# EAGLE design fancoil (EAGLE 9.6.2)
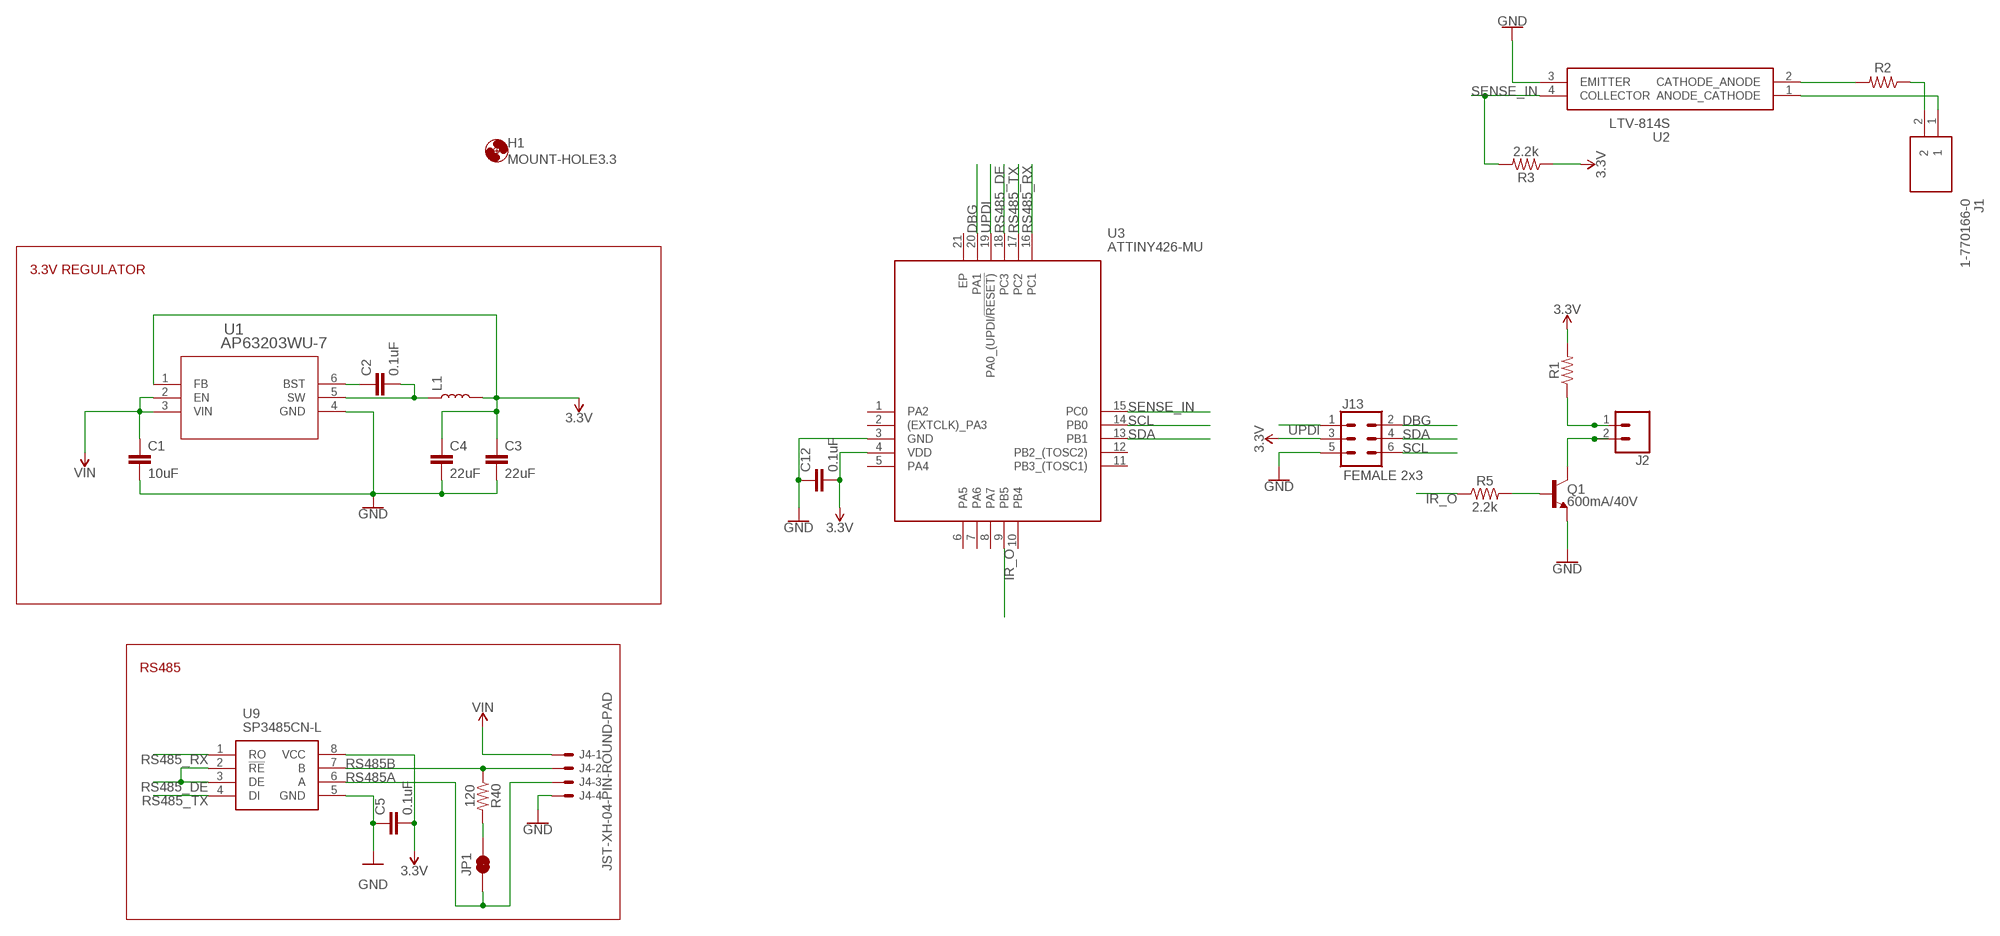
[diagram p0: schematic, sheet 1]

## Parts
C1  10uF  10UF-1206-6.3V-20%  [1206]
C2  0.1uF  0.1UF-0603-25V-5%  [0603]
C3  22uF  22UF-0805-6.3V-20%  [0805]
C4  22uF  22UF-0805-6.3V-20%  [0805]
C5  0.1uF  0.1UF-0603-25V-5%  [0603]
C12  0.1uF  0.1UF-0603-25V-5%  [0603]
H1  MOUNT-HOLE3.3  [3,3]
J1  1-770166-0  [17701660]
J2  CONN_02  [1X02]
J4  JST-XH-04-PIN-ROUND-PAD  [JST-XH-04-PACKAGE-ROUND-PAD]
J13  FEMALE 2x3  CONN_03X2FEMALE  [2X3]
JP1  JUMPER-SMT_2_NC_TRACE_NO-SILK  [SMT-JUMPER_2_NC_TRACE_NO-SILK]
L1  4.7μH_SHIELDED_INDUCTOR  [1008(2520)]
Q1  600mA/40V  TRANS_NPN-MMBT2222AL  [SOT23-3]
R1  68OHM-0603-1/10W-1%  [0603]
R2  RESISTORAXIAL-0.3  [AXIAL-0.3]
R3  2.2k  2.2KOHM-0603-1/10W-1%  [0603]
R5  2.2k  2.2KOHM-0603-1/10W-1%  [0603]
R40  120  120OHM-0603-1/10W-5%  [0603]
U1  AP63203WU-7  [SOIC_05WU-7_DIO]
U2  LTV-814S  [SOP254P1016X460-4N]
U3  ATTINY426-MU  [QFN40P300X300X90-21N]
U9  SP3485CN-L  [SOIC127P600X175-8N]

## Nets
3.3V: C3.1 C4.1 C5.2 C12.2 J13.3 L1.2 R1.2 R3.1 U1.1(FB) U3.4(VDD) U9.8(VCC)
DBG: J13.2 U3.20(PA1)
GND: C1.2 C3.2 C4.2 C5.1 C12.1 J4.4 J13.5 Q1.2(E) U1.4(GND) U2.3(EMITTER) U3.3(GND) U9.5(GND)
IR_O: R5.1 U3.9(PB5)
N$1: C2.2 L1.1 U1.5(SW)
N$2: C2.1 U1.6(BST)
N$3: JP1.2 R40.2
N$4: J2.1 R1.1
N$5: Q1.1(B) R5.2
N$6: J1.2 R2.P$1
N$7: J1.1 U2.1(ANODE_CATHODE)
N$8: R2.P$2 U2.2(CATHODE_ANODE)
N$10: J2.2 Q1.3(C)
RS485_DE: U3.18(PC3) U9.2(!RE) U9.3(DE)
RS485_RX: U3.16(PC1) U9.1(RO)
RS485_TX: U3.17(PC2) U9.4(DI)
RS485A: J4.3 JP1.1 U9.6(A)
RS485B: J4.2 R40.1 U9.7(B)
SCL: J13.6 U3.14(PB0)
SDA: J13.4 U3.13(PB1)
SENSE_IN: R3.2 U2.4(COLLECTOR) U3.15(PC0)
UPDI: J13.1 U3.19(PA0_(UPDI/!RESET))
VIN: C1.1 J4.1 U1.2(EN) U1.3(VIN)
Unconnected: U3.1(PA2) U3.2((EXTCLK)_PA3) U3.5(PA4) U3.6(PA5) U3.7(PA6) U3.8(PA7) U3.10(PB4) U3.11(PB3_(TOSC1)) U3.12(PB2_(TOSC2)) U3.21(EP)

## Notes on the sheet
- 3.3V REGULATOR
- RS485

## Library data of the parts
C1 = SparkFun-Capacitors:10UF: 10.0µF ceramic capacitors A capacitor is a passive two-terminal electrical component used to store electrical energy temporarily in an electric field.; PROD_ID: CAP-10057
C2 C5 C12 = SparkFun-Capacitors:0.1UF: 0.1µF ceramic capacitors A capacitor is a passive two-terminal electrical component used to store electrical energy temporarily in an electric field.; PROD_ID: CAP-08604
C3 C4 = SparkFun-Capacitors:22UF: 22µF ceramic capacitors A capacitor is a passive two-terminal electrical component used to store electrical energy temporarily in an electric field.; PROD_ID: CAP-08402
H1 = holes:MOUNT-HOLE: MOUNTING HOLE with drill center marker
J1 = Terminals and sockets:1-770166-0: 2w Vertical pin header Tin TE Connectivity MATE-N-LOK Series, 4.14mm Pitch 2 Way Straight Heavy Duty Power Connector, Solder Termination, 9.5A Source: Datasheet <https://www.te.com/commerce/DocumentDelivery/DDEController?Action=showdoc&DocId=Customer Drawing770166MpdfEnglishENG_CD_770166_M.pdf1-770166-0>; DESCRIPTION: 2w Vertical pin header Tin TE Connectivity MATE-N-LOK Series, 4.14mm Pitch 2 Way Straight Heavy Duty Power Connector, Solder Termination, 9.5A; HEIGHT: 14.25mm; MANUFACTURER_NAME: TE Connectivity; MANUFACTURER_PART_NUMBER: 1-770166-0; MOUSER_PART_NUMBER: 571-1-770166-0; MOUSER_PRICE-STOCK: https://www.mouser.co.uk/ProductDetail/TE-Connectivity-AMP/1-770166-0?qs=m8myXnDJXpW%252BZqFFniy0cw%3D%3D
J2 = SparkFun-Connectors:CONN_02: Multi connection point. Often used as Generic Header-pin footprint for 0.1 inch spaced/style header connections On any of the 0.1 inch spaced packages, you can populate with these: Break Away Headers - Straight <https://www.sparkfun.com/products/116> (PRT-00116) Break Away Male Headers - Right Angle <https://www.sparkfun.com/products/553> (PRT-00553) Female Headers <https://www.sparkfun.com/products/115> (PRT-00115) Break Away Headers - Machine Pin <https://www.sparkfun.com/products/117> (PRT-00117) Break Away Female Headers - Swiss Machine Pin <https://www.sparkfun.com/products/743> (PRT-00743) For SCREWTERMINALS and SPRING TERMINALS visit here: Screw Terimnals on SparkFun.com <https://www.sparkfun.com/search/results?term=Screw+Terminals> (5mm/3.5mm/2.54mm spacing) This device is also useful as a general connection point to wire up your design to another part of your project. Our various solder wires solder well into these plated through hole pads. Hook-Up Wire - Assortment (Stranded, 22 AWG) <https://www.sparkfun.com/products/11375> (PRT-11375) Hook-Up Wire - Assortment (Solid Core, 22 AWG) <https://www.sparkfun.com/products/11367> (PRT-11367) View the entire wire category on our website here <https://www.sparkfun.com/categories/141> Special notes: Molex polarized connector foot print use with: PRT-08233 with associated crimp pins and housings. 2.54_SCREWTERM for use with PRT-10571. 3.5mm Screw Terminal footprints for PRT-08084 5mm Screw Terminal footprints for use with PRT-08432
J4 = Rembrandt Electronics - JST XH Connectors v1-0:JST-XH-04-PIN: JST XH Connector 2 Pin Wire to board connector. Pitch: 2,54 mm, (0.100") Number of pins: 4 Created by Rembrandt Electronics www.rembrandtelectronics.com
J13 = SparkFun-Connectors:CONN_03X2: Multi connection point. Often used as Generic Header-pin footprint for 0.1 inch spaced/style header connections You can populate with any combo of single row headers, but if you'd like an exact match, check these: Header - 2x3 (Male, 0.1") <https://www.sparkfun.com/products/12807> (PRT-12807) Header - 2x3 (Female, 0.1") <https://www.sparkfun.com/products/13010> (PRT-13010) 2x3 Pin Shrouded Header <https://www.sparkfun.com/products/10877> (PRT-10877) On any of the 0.1 inch spaced packages, you can populate with these: Break Away Headers - Straight <https://www.sparkfun.com/products/116> (PRT-00116) Break Away Male Headers - Right Angle <https://www.sparkfun.com/products/553> (PRT-00553) Female Headers <https://www.sparkfun.com/products/115> (PRT-00115) Break Away Headers - Machine Pin <https://www.sparkfun.com/products/117> (PRT-00117) Break Away Female Headers - Swiss Machine Pin <https://www.sparkfun.com/products/743> (PRT-00743) Special note: the shrouded connector mates well with our 3x2 ribbon cables: Ribbon Crimp Connector - 6-pin (2x3, Female) <https://www.sparkfun.com/products/10651> (PRT-10651) Ribbon Cable - 6 wire (15ft) <https://www.sparkfun.com/products/10646> (PRT-10646); PROD_ID: CONN-11566
JP1 = SparkFun-Jumpers:JUMPER-SMT_2_NC_TRACE: Normally closed trace jumper This jumper has a trace between two pads so it's normally closed (NC). Use a razor knife to open the connection. For best results follow the IPC guidelines for cutting traces: Cutout at least 0.063 mm (0.005 in). Remove all loose material to clean up the cut area. Seal the cut with an approved epoxy. Reapply solder to reclose the connection.
L1 = SparkFun-Coils:4.7μH_SHIELDED_INDUCTOR: 4.7uH Inductor 4.7uH 1.4A 50mOhm 1008(2520) Package Shielded; PROD_ID: NDUC-14880
Q1 = SparkFun-DiscreteSemi:TRANS_NPN: NPN transistor Current controlled devices typically used to amplify current or used as a switch. BC547 - COM-08928 <http://www.sparkfun.com/products/8928> (TO-92 45V 100mA) (1.Collector 2.Base 3.Emitter) 2N3904 - COM-00521 <http://www.sparkfun.com/products/521> (TO-92 40V 200mA) (1.Emitter 2.Base 3.Collector) P2N2222A - COM-12852 <http://www.sparkfun.com/products/12852> (TO-92 40V 600mA) (1.Collector 2.Base 3.Emitter); PROD_ID: TRANS-08049
R1 = SparkFun-Resistors:68OHM: 68Ω resistor A resistor is a passive two-terminal electrical component that implements electrical resistance as a circuit element. Resistors act to reduce current flow, and, at the same time, act to lower voltage levels within circuits. - Wikipedia
R2 = SparkFun-Resistors:RESISTOR: Generic Resistor Package
R3 R5 = SparkFun-Resistors:2.2KOHM: 2.2kΩ resistor A resistor is a passive two-terminal electrical component that implements electrical resistance as a circuit element. Resistors act to reduce current flow, and, at the same time, act to lower voltage levels within circuits. - Wikipedia; PROD_ID: RES-08272
R40 = Resistors:120OHM
U1 = Diodes buck converter:AP63203WU-7; COPYRIGHT: Copyright (C) 2023 Ultra Librarian. All rights reserved.; MANUFACTURER_PART_NUMBER: AP63203WU-7; MFR_NAME: Diodes Inc
U2 = LiteOn AC optoisolator LTV:LTV-814S: Optocoupler LTV-814S Source: Datasheet <https://datasheet.datasheetarchive.com/originals/distributors/Datasheets-17/DSA-322887.pdf>; DESCRIPTION: Optocoupler LTV-814S; HEIGHT: 4.6mm; MANUFACTURER_NAME: Lite-On; MANUFACTURER_PART_NUMBER: LTV-814S; MOUSER_PART_NUMBER: 859-LTV-814S; MOUSER_PRICE-STOCK: https://www.mouser.co.uk/ProductDetail/Lite-On/LTV-814S?qs=JzJdhgWJh%252BMQRrTS0RmA%252BA%3D%3D
U3 = ATTINY426-MU:ATTINY426-MU: 8-bit Microcontrollers - MCU 20MHz, 4KB,VQFN20, Ind 85C, Green Source: Datasheet <https://www.microchip.com/content/dam/mchp/documents/MCU08/ProductDocuments/DataSheets/ATtiny424-426-427-824-826-827-DataSheet-DS40002311A.pdf>; DESCRIPTION: 8-bit Microcontrollers - MCU 20MHz, 4KB,VQFN20, Ind 85C, Green; HEIGHT: 0.9mm; MANUFACTURER_NAME: Microchip; MANUFACTURER_PART_NUMBER: ATTINY426-MU; MOUSER_PART_NUMBER: 579-ATTINY426-MU; MOUSER_PRICE-STOCK: https://www.mouser.co.uk/ProductDetail/Microchip-Technology/ATTINY426-MU?qs=pUKx8fyJudAatJqFKBSQfg%3D%3D
U9 = MaxLinear RS485 SP3485CN-L:SP3485CN-L: Transceiver RS-485 3.3V 10Mbps SOIC8 EXAR SP3485CN-L, Line Transceiver, RS-422, RS-485, 3.3 V, 8-Pin SOIC Source: Datasheet <https://componentsearchengine.com/Datasheets/1/SP3485CN-L.pdf>; DESCRIPTION: Transceiver RS-485 3.3V 10Mbps SOIC8 EXAR SP3485CN-L, Line Transceiver, RS-422, RS-485, 3.3 V, 8-Pin SOIC; HEIGHT: 1.75mm; MANUFACTURER_NAME: EXAR; MANUFACTURER_PART_NUMBER: SP3485CN-L; MOUSER_PART_NUMBER: 701-SP3485CN-L; MOUSER_PRICE-STOCK: https://www.mouser.com/Search/Refine.aspx?Keyword=701-SP3485CN-L

## Board
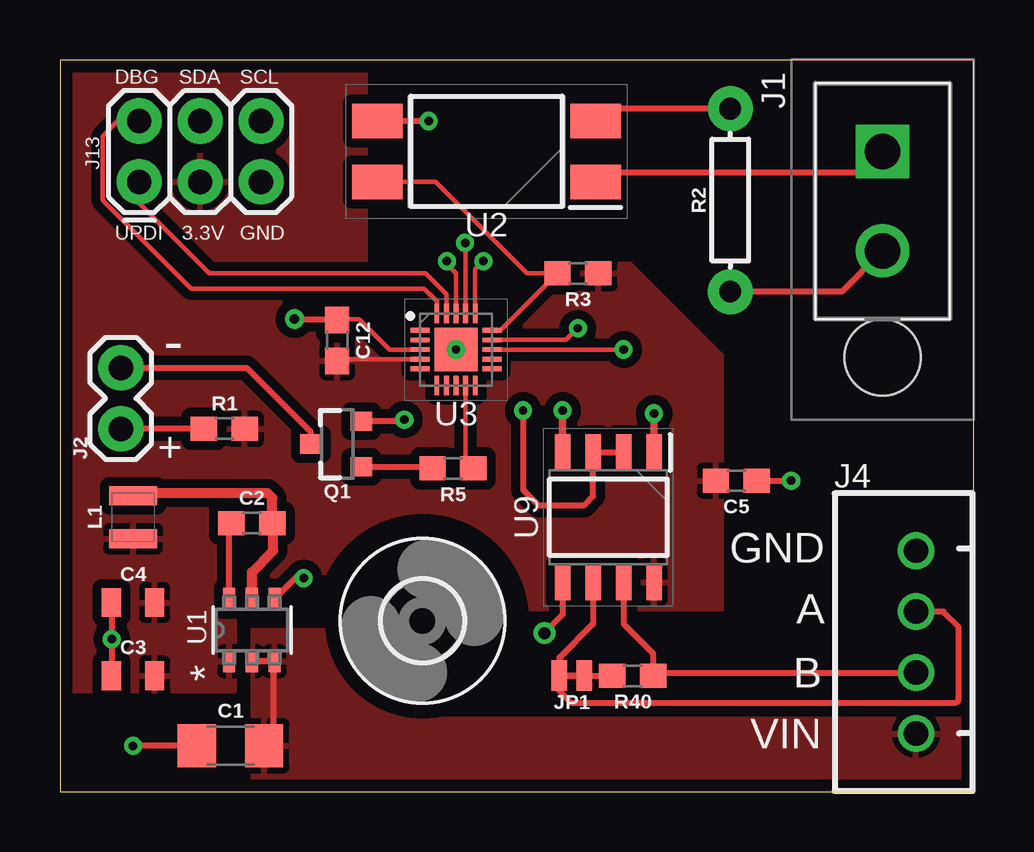
[diagram p1: board, top side]
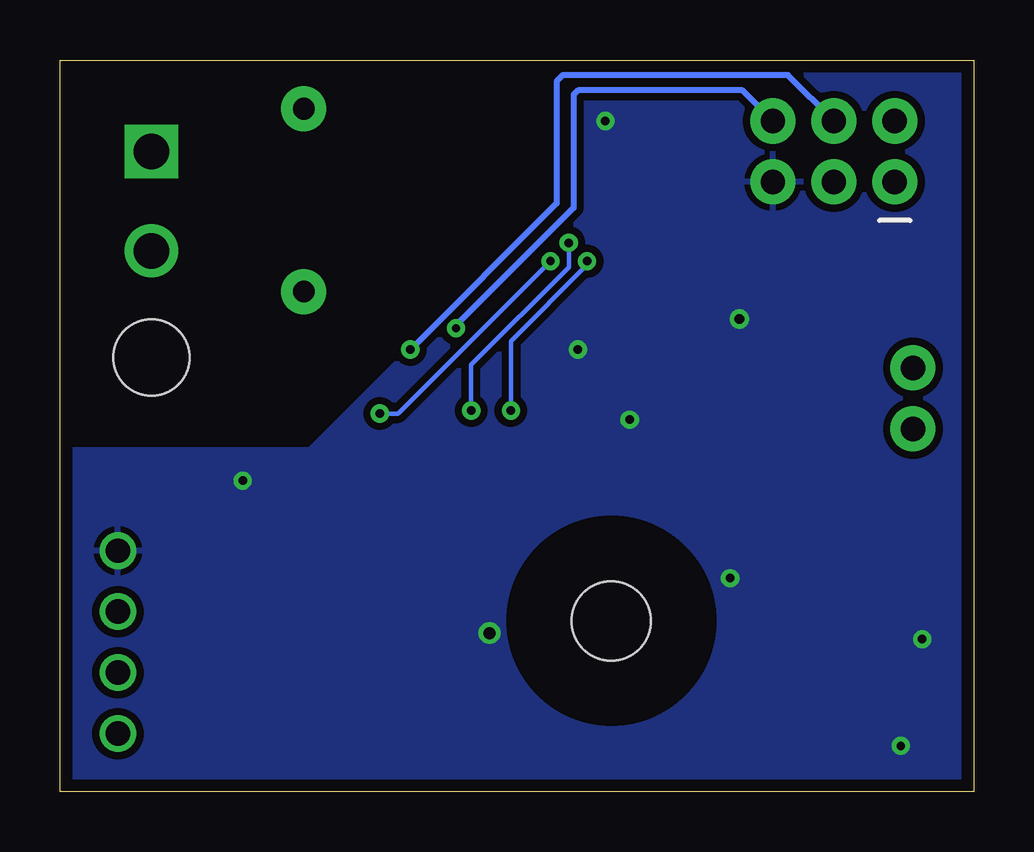
[diagram p2: board, bottom side, seen from below]

Size 38.1 x 30.48 mm. Coordinates in mm from the lower left corner, seen from the top.
Outline: 0,0 38.1,0 38.1,30.48 0,30.48 0,0
Copper layers (1*16): Top 0.035mm / dielectric 1.6mm / Bottom 0.035mm
Design rules "Elecrow_2-layer_PCB_eagle_rule_conservative *": minimum track width 7mil, minimum drill 12mil, track to track 8mil, track to pad 6mil, pad to pad 6mil, via to via 8mil, smd to smd 0mil, copper to edge 20mil, drill to drill 10mil, minimum pad ring 8mil, minimum via ring 8mil, stop-mask expansion 0mil, vias tented up to drill 100mil, thermal gap 10mil

### Footprints (pad centres in the part's own frame; a part is rotated, then mirrored left to right if it is on the bottom)
1206 = smd 1.6 x 1.8: 1 -1.4,0; 2 1.4,0
0603 = smd 1.1 x 1: 1 -0.85,0; 2 0.85,0
0805 = smd 0.8 x 1.2: 1 -0.9,0; 2 0.9,0
3,3 = hole 3.3: 0,0
17701660 = drill 1.48 pad 2.22 square: 1 0,0 | drill 1.48 pad 2.22: 2 4.14,0 | hole 3.18: 8.59,0
1X02 = drill 1.016 pad 1.88: 1 0,0; 2 2.54,0
JST-XH-04-PACKAGE-ROUND-PAD = drill 1.016: 1 -3.81,0; 2 -1.27,0; 3 1.27,0; 4 3.81,0
2X3 = drill 1.016 pad 1.88: 1 0,0; 2 0,2.54; 3 2.54,0; 4 2.54,2.54; 5 5.08,0; 6 5.08,2.54
SMT-JUMPER_2_NC_TRACE_NO-SILK = smd 0.66 x 1.27: 1 -0.521,0; 2 0.521,0
1008(2520) = smd 0.8 x 2: 1 -0.9,0; 2 0.9,0
SOT23-3 = smd 0.8 x 0.9: 1 -0.95,-1; 2 0.95,-1; 3 0,1.1
AXIAL-0.3 = drill 0.9 pad 1.88: P$1 -3.81,0; P$2 3.81,0
SOIC_05WU-7_DIO = smd 0.902 x 0.508: 1 -1.302,0.95; 2 -1.302,0; 3 -1.302,-0.95; 4 1.302,-0.95; 5 1.302,0; 6 1.302,0.95
SOP254P1016X460-4N = smd 2.1 x 1.45: 1 -4.55,1.27; 2 -4.55,-1.27; 3 4.55,-1.27; 4 4.55,1.27
QFN40P300X300X90-21N = smd 0.8 x 0.2: 1 -1.5,0.8; 2 -1.5,0.4; 3 -1.5,0; 4 -1.5,-0.4; 5 -1.5,-0.8; 11 1.5,-0.8; 12 1.5,-0.4; 13 1.5,0; 14 1.5,0.4; 15 1.5,0.8 | smd 0.2 x 0.8: 6 -0.8,-1.5; 7 -0.4,-1.5; 8 0,-1.5; 9 0.4,-1.5; 10 0.8,-1.5; 16 0.8,1.5; 17 0.4,1.5; 18 0,1.5; 19 -0.4,1.5; 20 -0.8,1.5 | smd 1.8 x 1.8: 21 0,0
SOIC127P600X175-8N = smd 1.5 x 0.65: 1 -2.7,1.905; 2 -2.7,0.635; 3 -2.7,-0.635; 4 -2.7,-1.905; 5 2.7,-1.905; 6 2.7,-0.635; 7 2.7,0.635; 8 2.7,1.905

### Placement (x,y rotation side)
C1  7.11,1.91 180 top
C2  8,11.18 0 top
C3  3.05,4.83 180 top
C4  3.05,7.87 180 top
C5  28.19,12.95 180 top
C12  11.56,18.8 270 top
H1  15.11,7.11 0 top
J1  34.29,26.67 270 top
J2  2.54,15.11 90 top
J4  35.69,6.22 90 top
J13  3.3,25.4 0 top
JP1  21.34,4.83 0 top
L1  3.05,11.43 270 top
Q1  11.56,14.48 90 top
R1  6.86,15.11 0 top
R2  27.94,24.64 90 top
R3  21.59,21.59 180 top
R5  16.38,13.46 180 top
R40  23.88,4.83 180 top
U1  8,6.73 90 top
U2  17.78,26.67 180 top
U3  16.51,18.41 0 top
U9  22.86,11.43 270 top

### Tracks (layer width: path | path; a pad name or v marks a point on that pad's centre or on a via)
3.3V
  Top 0.178: U3.4 11.56,18.02 C12.2
  pour Top (isolate 0.381): 0,30.48 12.7,30.48 12.7,21.97 23.75,21.97 27.56,18.16 27.56,7.62 7.24,7.62 7.24,4.19 0,4.19
DBG
  Top 0.178: U3.20 15.71,20.42 15.18,20.95 5.46,20.95 1.78,24.64 1.78,27.3 2.41,27.94 J13.2
GND  (via drill 0.35, 0.4, 0.5)
  Top 0.178: 11.52,19.68 C12.1 11.6,19.68 12.47,19.68 13.74,18.41 U3.3
  Top 0.254: C4.2 v2.16,6.35 C3.2 | C1.2 v3.05,1.91 | v9.78,19.68 11.52,19.68 | U9.5 20.95,7.37 v20.19,6.6 | U1.4 9.81,8.89 v10.16,8.89 | U2.3 v15.37,27.94 | v14.35,15.49 14.29,15.43 Q1.2 | C5.1 v30.48,12.95
  other vias: 16.51,18.41
  pour Bottom (isolate 0.305): 0,30.48 17.78,30.48 17.78,24.13 27.69,14.22 39.37,14.22 39.37,0 0,0
IR_O
  Top 0.178: U3.9 16.91,13.79
  Top 0.203: 16.91,13.79 R5.1
N$1
  Top 0.254: 8.89,11.14 C2.2 | L1.1 3.16,12.45
  Top 0.406: U1.5 8,9.14 8.89,10.03 8.89,11.14 | C2.2 8.85,12.23 8.64,12.45 3.16,12.45
N$2
  Top 0.254: U1.6 7.05,11.08 C2.1
N$3
  Top 0.254: JP1.2 R40.2
N$4
  Top 0.254: R1.1 J2.1
N$5
  Top 0.254: Q1.1 15.47,13.53 R5.2
N$6
  Top 0.254: R2.P$1 32.59,20.83 J1.2
N$7
  Top 0.254: J1.1 33.4,25.78 22.71,25.78 U2.1
N$8
  Top 0.254: U2.2 22.84,28.45 R2.P$2
N$10
  Top 0.254: J2.2 7.79,17.65 10.46,14.99 Q1.3
RS485_DE  (via drill 0.35)
  Top 0.178: U3.18 16.51,21.59 16.13,21.97 v16.13,22.1
  Top 0.254: U9.2 U9.3 22.23,12.32 21.84,11.94 19.94,11.94 19.3,12.57 v19.3,15.88
  Bottom 0.178: v16.13,22.1 16.13,21.94 19.3,18.77 v19.3,15.88
RS485_RX  (via drill 0.35)
  Top 0.178: U3.16 17.31,21.75 v17.65,22.1
  Top 0.305: v24.77,15.75 U9.1
  Bottom 0.178: v24.77,15.75 24,15.75 v17.65,22.1
RS485_TX  (via drill 0.35)
  Top 0.178: U3.17 16.91,22.84 v16.89,22.86
  Top 0.305: v20.95,15.88 U9.4
  Bottom 0.178: v20.95,15.88 20.95,17.78 16.89,21.84 v16.89,22.86
RS485A
  Top 0.254: U9.6 22.23,6.99 20.82,5.58 JP1.1 20.82,4.2 21.31,3.71 37.36,3.71 37.47,3.81 37.47,6.86 36.83,7.49 J4.3
RS485B
  Top 0.254: U9.7 23.5,6.99 24.73,5.75 R40.1 24.85,4.95 J4.2
SCL  (via drill 0.35)
  Top 0.178: v21.59,19.3 21.1,18.82 U3.14
  Bottom 0.254: J13.6 9.65,29.21 16.51,29.21 16.69,29.03 16.69,24.32 21.59,19.42 v21.59,19.3
SDA  (via drill 0.35)
  Top 0.178: U3.13 v23.5,18.41
  Bottom 0.254: J13.4 7.75,29.84 17.14,29.84 17.4,29.59 17.4,24.51 v23.5,18.41
SENSE_IN
  Top 0.178: U3.15 18.36,19.21 R3.2 19.47,21.59 15.66,25.4 U2.4
UPDI
  Top 0.178: U3.19 16.11,20.72 15.24,21.59 6.22,21.59 3.3,24.51 J13.1
VIN
  Top 0.254: U1.2 U1.3 8.89,5.37 8.89,2.28 C1.1
  pour Top (rank 2): 8,6.73 8,0 38.1,0 38.1,3.05 14.73,3.05 11.05,6.73

### Text on the board
tNames: DBG | SDA | SCL | UPDI | 3.3V | GND | - | + | GND | A | B | VIN